# Altium schematic sheet Power.SchDoc
size C
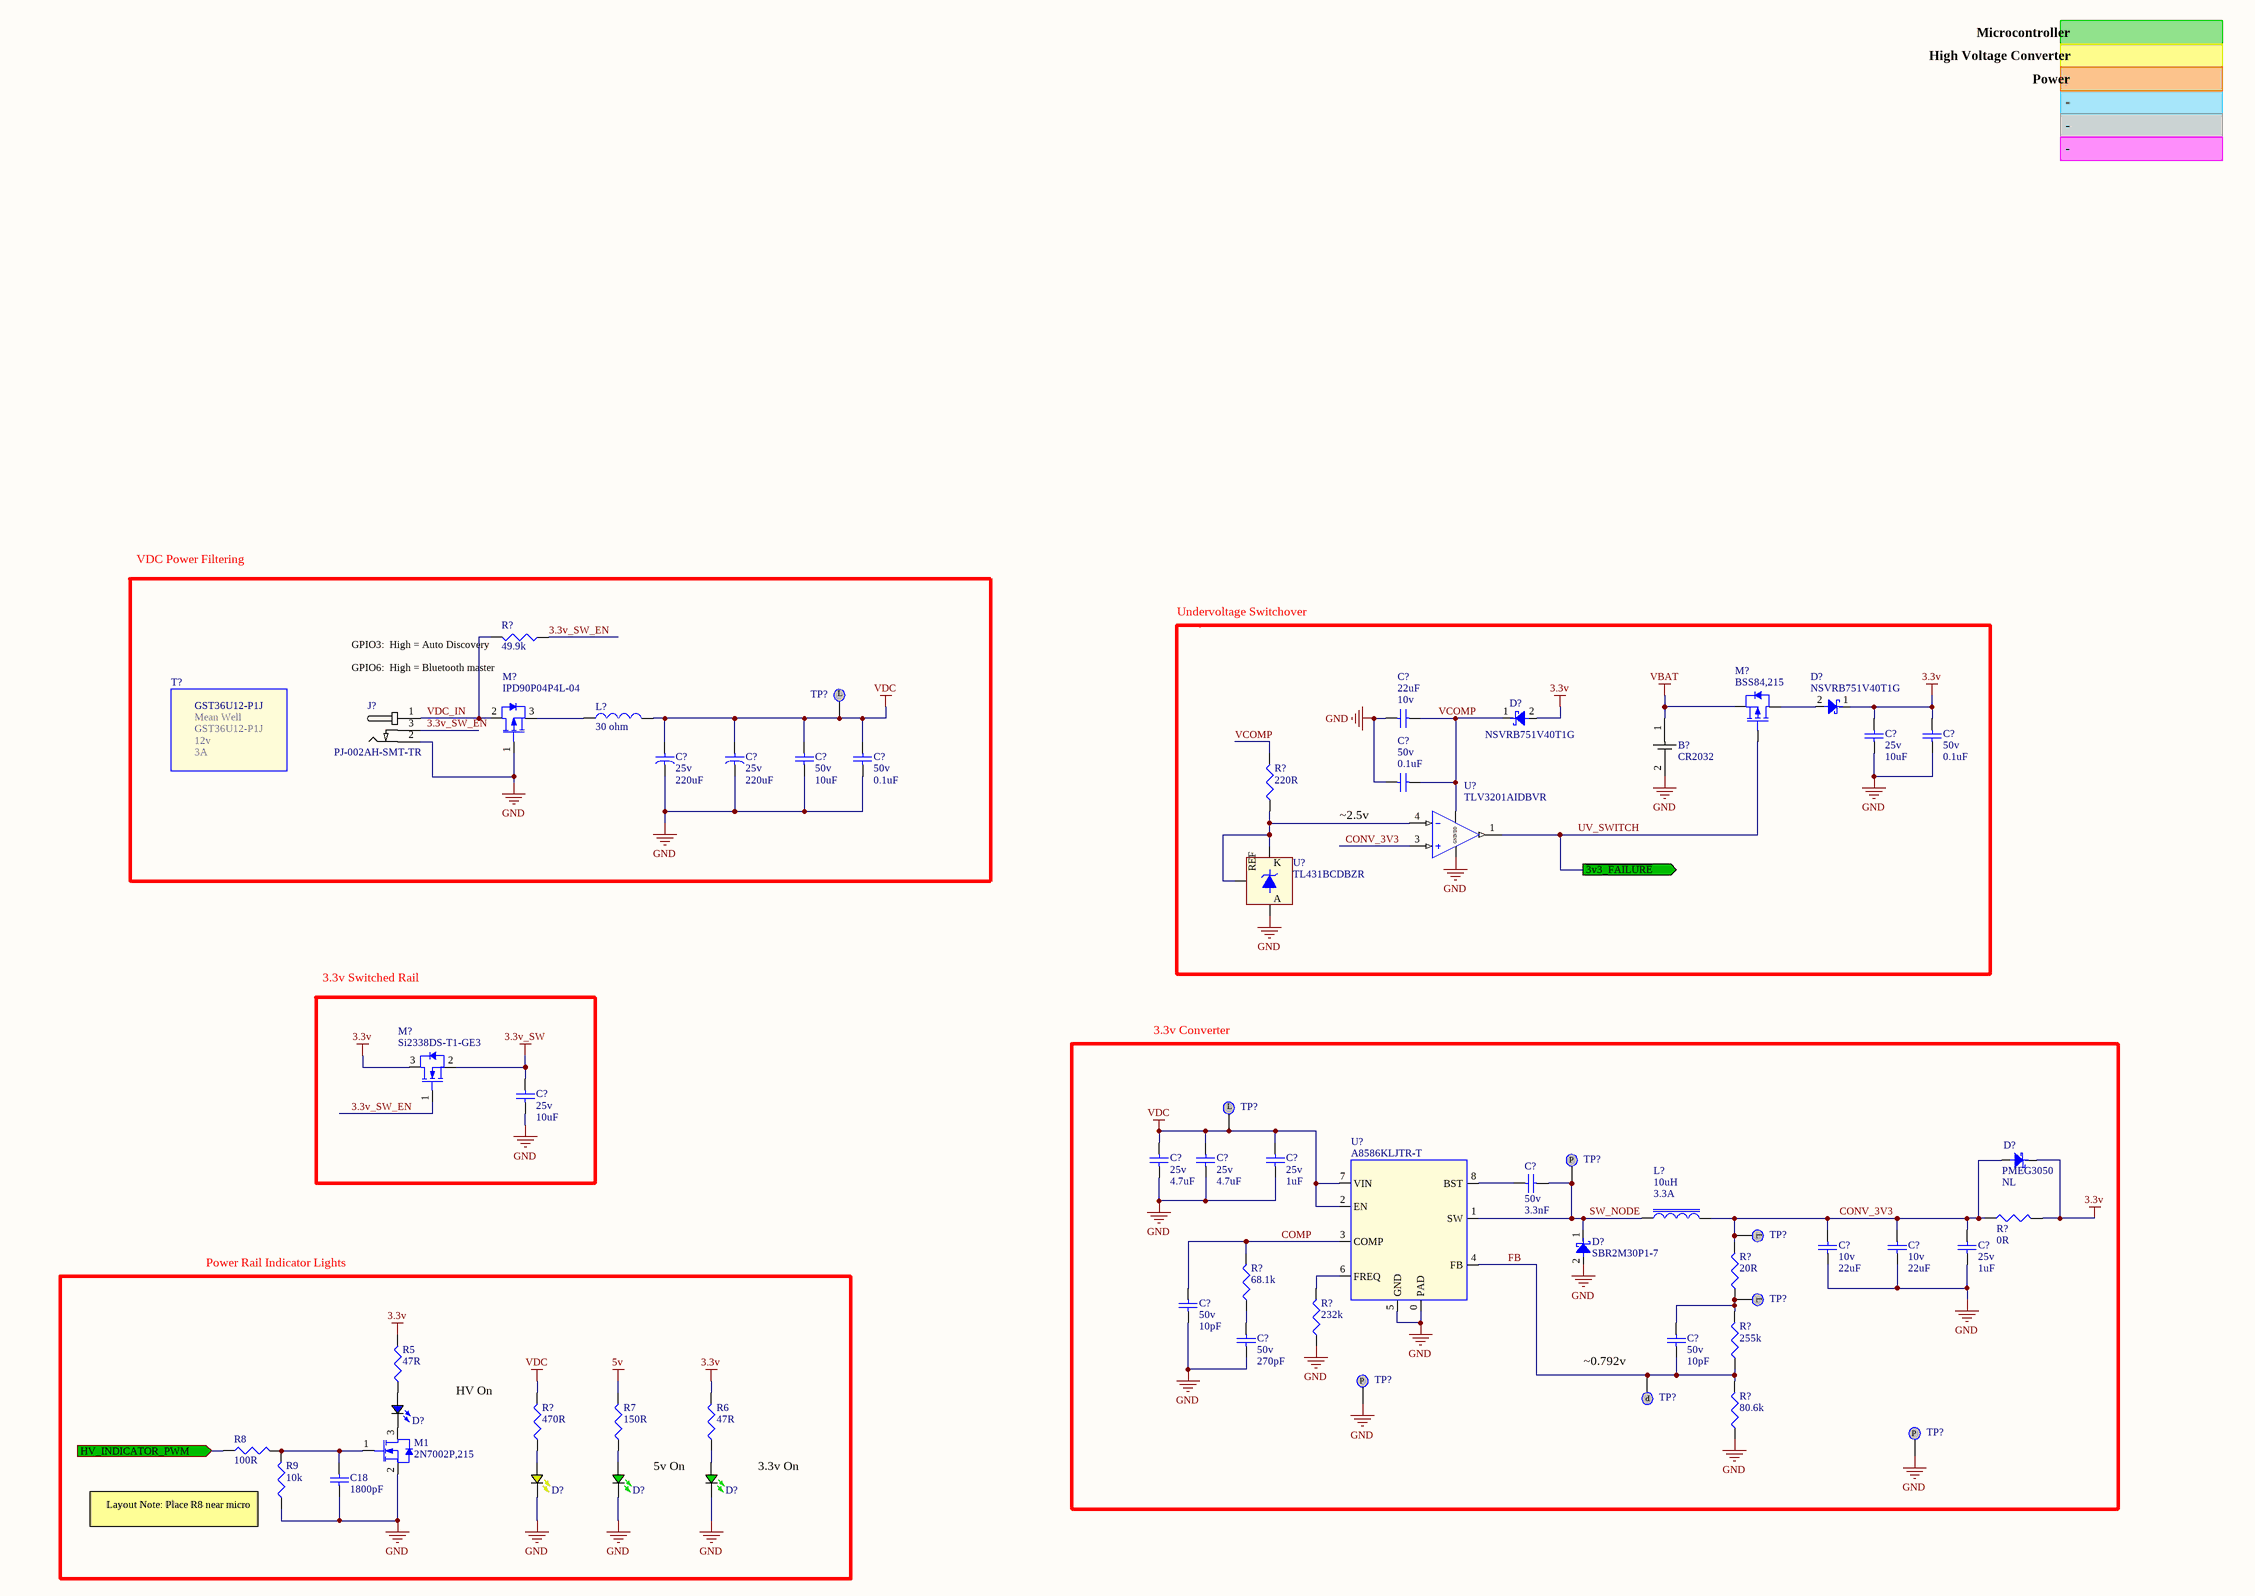
[diagram p0: Power.SchDoc]

## Parts
(Parts that share a designator on the sheet are numbered #1, #2 ... from top to bottom, then left to right.)
B?  CR2032  [2032 Holder]
C18  1800pF  [CAP0603R]
C?#1  Voltage: 10v  [CAP1210R]  (hidden comment: 22uF)
C?#2  Voltage: 25v  [CAP1206R]  (hidden comment: 10uF)
C?#3  Voltage: 50v  [CAP0603R]  (hidden comment: 0.1uF)
C?#4  Voltage: 25v  [SMD ELEC CAP (D=6.3, L=7.7, H=8)]  (hidden comment: 220uF)
C?#5  Voltage: 25v  [SMD ELEC CAP (D=6.3, L=7.7, H=8)]  (hidden comment: 220uF)
C?#6  Voltage: 50v  [CAP1206R]  (hidden comment: 10uF)
C?#7  Voltage: 50v  [CAP0603R]  (hidden comment: 0.1uF)
C?#8  Voltage: 50v  [CAP0603R]  (hidden comment: 0.1uF)
C?#9  Voltage: 25v  [CAP1206R]  (hidden comment: 10uF)
C?#10  Voltage: 25v  [CAP1206R]  (hidden comment: 4.7uF)
C?#11  Voltage: 25v  [CAP1206R]  (hidden comment: 4.7uF)
C?#12  Voltage: 25v  [CAP0603R]  (hidden comment: 1uF)
C?#13  Voltage: 50v  [CAP0603R]  (hidden comment: 3.3nF)
C?#14  Voltage: 10v  [CAP1210R]  (hidden comment: 22uF)
C?#15  Voltage: 10v  [CAP1210R]  (hidden comment: 22uF)
C?#16  Voltage: 25v  [CAP0603R]  (hidden comment: 1uF)
C?#17  Voltage: 50v  [CAP0402R]  (hidden comment: 10pF)
C?#18  Voltage: 50v  [CAP0603R]  (hidden comment: 270pF)
C?#19  Voltage: 50v  [CAP0402R]  (hidden comment: 10pF)
D?#1  NSVRB751V40T1G  [SOD-323 (SC-90)]
D?#2  NSVRB751V40T1G  [SOD-323 (SC-90)]
D?#3  PMEG3050  LOAD: NL  [SOD128]
D?#4  SBR2M30P1-7  [PowerDI123]
D?#5  LTST-C193TBKT-5A  (value not drawn)
D?#6  LTST-C190AKT  [LED Amber 0603]  (value not drawn)
D?#7  LTST-S270KGKT  [LED Green 0603]  (value not drawn)
D?#8  LTST-S270KGKT  [LED Green 0603]  (value not drawn)
J?  PJ-002AH-SMT-TR  [PJ-002AH-SMT-TR]
L?#1  30 ohm  [RES0805R]
L?#2  10uH  CURRENT: 3.3A
M1  2N7002P,215  [SOT23-3M]
M?#1  BSS84,215  [SOT23-3M]
M?#2  IPD90P04P4L-04  [DPAK2]
M?#3  Si2338DS-T1-GE3  [SOT23-3M]
R5  47R  [RES0603R]
R6  47R  [RES0603R]
R7  150R  [RES0603R]
R8  100R  [RES0603R]
R9  10k  [RES0603R]
R?#1  49.9k  [RES0402R]
R?#2  220R  [RES0402R]
R?#3  0R  [RES1206R]
R?#4  20R  [RES0402R]
R?#5  68.1k  [RES0402R]
R?#6  232k  [RES0402R]
R?#7  255k  [RES0402R]
R?#8  80.6k  [RES0402R]
R?#9  470R  [RES0603R]
T?  GST36U12-P1J  MFG: Mean Well  VOUT: 12v  CURRENT: 3A
TP?#1  5001  [5001 Testpoint]  (value not drawn)
TP?#2  5001  [5001 Testpoint]  (value not drawn)
TP?#3  NONE  [TESTPOINT - 1.5mm Round Pad]  (value not drawn)
TP?#4  5001  [5001 Testpoint]  (value not drawn)
TP?#5  5001  [5001 Testpoint]  (value not drawn)
TP?#6  NONE  [TESTPOINT - 1.5mm Round Pad]  (value not drawn)
TP?#7  NONE  [TESTPOINT - 1.5mm Round Pad]  (value not drawn)
TP?#8  NONE  [TESTPOINT - 1.5mm Round Pad]  (value not drawn)
U?#1  TLV3201AIDBVR  [SOT23-5]
U?#2  TL431BCDBZR  [SOT23-3M]
U?#3  A8586KLJTR-T  [HSOIC-8]

## Blocks framed on the sheet
VDC Power Filtering: C?#4-C?#7 J? L?#1 M?#2 R?#1 T? TP?#1
3.3v Switched Rail: C?#9 M?#3

## Ports
HV_INDICATOR_PWM (in), ~{3v3_FAILURE} (out)

## Nets
3.3v: C?#2.1 C?#3.1 D?#1.1(K) D?#2.2(A) D?#3.1(K) M?#3.3(DRAIN) R5.2 R6.2 R?#3.2
3.3v_SW: C?#9.1 M?#3.2(SOURCE)
5v: R7.2
GND: B?.2 C18.2 C?#1.2 C?#2.2 C?#3.2 C?#4.1 C?#5.1 C?#6.2 C?#7.2 C?#8.2 C?#9.2 C?#10.2 C?#11.2 C?#12.2 C?#14.2 C?#15.2 C?#16.2 C?#17.2 C?#18.2 D?#4.2(A) D?#6.1(K) D?#7.1(K) D?#8.1(K) J?.2(RING) M1.2(SOURCE) M?#2.1(GATE) R9.1 R?#6.1 R?#8.1 TP?#7.1 TP?#8.1 U?#1.2(GND) U?#2.3(A) U?#3.0(PAD) U?#3.5(GND)
VBAT: B?.1 M?#1.2(DRAIN)
VDC: C?#4.2 C?#5.2 C?#6.1 C?#7.1 C?#10.1 C?#11.1 C?#12.1 L?#1.2 R?#9.2 TP?#1.1 TP?#2.1 U?#3.2(EN) U?#3.7(VIN)
3.3v_SW_EN: J?.3(SWITCH) M?#3.1(GATE) R?#1.1
COMP: C?#17.1 R?#5.2 U?#3.3(COMP)
CONV_3V3: C?#14.1 C?#15.1 C?#16.1 D?#3.2(A) L?#2.2 R?#3.1 R?#4.2 TP?#4.1 U?#1.3(+)
FB: C?#19.2 R?#7.1 R?#8.2 TP?#6.1 U?#3.4(FB)
HV_INDICATOR_PWM: R8.1 ; port HV_INDICATOR_PWM
SW_NODE: C?#13.2 D?#4.1(K) L?#2.1 TP?#3.1 U?#3.1(SW)
UV_SWITCH: M?#1.1(GATE) U?#1.1(OUT) ; port ~{3v3_FAILURE}
VCOMP: C?#1.1 C?#8.1 D?#2.1(K) R?#2.2 U?#1.5(VDD)
VDC_IN: J?.1(PIN) M?#2.2(DRAIN) R?#1.2
NetC18_1: C18.1 M1.1(GATE) R8.2 R9.2
NetC?#13_1: C?#13.1 U?#3.8(BST)
NetC?#18_1: C?#18.1 R?#5.1
NetC?#19_1: C?#19.1 R?#4.1 R?#7.2 TP?#5.1
NetD?#1_2: D?#1.2(A) M?#1.3(SOURCE)
NetD?#5_1: D?#5.1(K) M1.3(DRAIN)
NetD?#5_2: D?#5.2(A) R5.1
NetD?#6_2: D?#6.2(A) R?#9.1
NetD?#7_2: D?#7.2(A) R7.1
NetD?#8_2: D?#8.2(A) R6.1
NetL?#1_1: L?#1.1 M?#2.3(SOURCE)
NetR?#2_1: R?#2.1 U?#1.4(-) U?#2.1(K) U?#2.2(REF)
NetR?#6_2: R?#6.2 U?#3.6(FREQ)

## Notes on the sheet
- Microcontroller
- High Voltage Converter
- -
- Power
- Undervoltage Switchover
- (near C?#8) ~2.5v
- 3.3v Converter
- Power Rail Indicator Lights
- HV On
- (near TP?#6) ~0.792v
- (near D?#7) 5v On
- (near D?#8) 3.3v On
- (near R9) Layout Note: Place R8 near micro
- (in symbol GST36U12-P1J) GPIO3:  High = Auto Discovery / GPIO6:  High = Bluetooth master / GPIO7:  Low = 115200bps, High = 9600bps /
- (in symbol Testpoint 1.5mm Pad) P
- (in symbol Testpoint Loop) L

## Library data of the parts
B? = 2032 Coin Cell Holder: SMD Coin Cell Holder for CR2032; MFG_PN: SMTU2032-LF.TR; MFG: RENATA; CELL_TYPE: CR2032
C18 = 1800pF: Tolerance: 5%; MFG1_PN: VJ0603Y182JXAAC; MFG1: Vishay; Voltage: 50v; Value: 1800pF
C?#1 C?#14 C?#15 = 22uF 10v (1210): Tolerance: 10%; MFG_PN: GCM32ER71A226ME12L; MFG: MURATA; LOAD: NL; Value: 22uF
C?#2 C?#9 = 10uF 25v (1206): Tolerance: 10%; MFG_PN: GRJ31CR71E106KE11L; MFG: MURATA; LOAD: NL; Value: 10uF
C?#3 C?#7 C?#8 = 0.1uF 50v (0603): MFG_PN: VJ0603V104ZXAPW1BC; MFG: Vishay; LOAD: NL; Value: 0.1uF
C?#4 C?#5 = 220uF / 25v: Tolerance: 20%; MFG_PN: EEE-FTE221XAP; MFG: PANASONIC; ESR: 160mohm; LOAD: NL; Value: 220uF
C?#6 = 10uF 50v (1206): Tolerance: 10%; MFG_PN: C3216X5R1H106K160AB; MFG: TDK; LOAD: NL; Value: 10uF
C?#10 C?#11 = 4.7uF 25v (1206): Tolerance: 10%; MFG_PN: GCM31CR71E475KA55L; MFG: Murata; LOAD: NL; Value: 4.7uF
C?#12 C?#16 = 1uF 25v (0603): MFG_PN: VJ0805V105ZXXTW1BC; MFG: Vishay; LOAD: NL; Value: 1uF
C?#13 = 47nF 50v (0603): Tolerance: 10%; MFG_PN: VJ0603Y473KXACW1BC; MFG: VISHAY; Value: 3.3nF
C?#17 C?#19 = 10pF 50v (0402): Tolerance: 10%; MFG_PN: VJ0402Y100KXACW1BC; MFG: Vishay; LOAD: NL; Value: 10pF
C?#18 = 270pF 50v (0603): Tolerance: 5%; MFG_PN: VJ0603A271JXACW1BC; MFG: Vishay; LOAD: NL; Value: 270pF
D?#1 D?#2 = NSVRB751V40T1G: Schottky, 30mA, 0.28v; MFG: ON Semiconductor; Vf: 0.28v; CURRENT: 30mA; MFG_PN: NSVRB751V40T1G
D?#3 = PMEG3050EP: MFG: NXP; CURRENT: 5A; VF: 0.35v; MFG_PN: PMEG3050EP,115
D?#4 = SBR2M30P1-7: Schottky Diode - 2A; MFG: DIODES INC; VF: 390mV; LOAD: NL; Value: *; CURRENT: 2A; MFG_PN: SBR2M30P1-7
D?#5 = LED Blue 0603: MFG: Lite On; VFORWARD: 2.8v; CURRENT: 20mA; COLOR: Blue; MFG_PN: LTST-C193TBKT-5A
D?#6 = LED Amber 0603: MFG: Lite On; VFORWARD: 2.1v; CURRENT: 20mA; COLOR: Amber; MFG_PN: LTST-C190AKT
D?#7 D?#8 = LED Green 0603: MFG: Lite On; VFORWARD: 2v; CURRENT: 20mA; COLOR: Green; MFG_PN: LTST-S270KGKT
J? = PJ-002AH-SMT-TR: 2.0mm ID/6.5mm OD Barrel Plug; MFG: CUI; VOLTAGE: 16v; CURRENT: 5A; MFG_PN: PJ-002AH-SMT-TR
L?#1 = EMI Ferrite (0805): MFG: MURATA; MFG_PN: BLM21PG300SN1D; CURRENT: 3A; LOAD: NL; TOLERANCE: 20%; IMPEDANCE: 30 ohm
L?#2 = 10uH 3.3A: Inductor, 10uH, 3.3A; MFG: LAIRD; MFG_PN: TYS8040100M-10; RES: 29mOhm; ISAT: 3.6A; VALUE: 10uH
M1 = 2N7002: NFET_SINGLE_360mA_60V; LOAD: NL; MFG: NXP; VDS_MAX: 60v; I_MAX: 360mA; VGS_MAX: 20v; P_MAX: *; RDS_ON: *; MFG_PN: 2N7002P,215
M?#1 = BSS84: PFET_SINGLE_130mA_50v; LOAD: NL; MFG: NXP; VDS_MAX: 50v; I_MAX: 130mA; VGS_MAX: 20v; P_MAX: 250mW; RDS_ON: 6R; MFG_PN: BSS84,215
M?#2 = IPD90P04P4L-04: PFET_SINGLE_90A_40v; LOAD: NL; MFG: INFINEON; VDS_MAX: -40v; I_MAX: 90A; VGS_MAX: 16v; P_MAX: 125W; RDS_ON: 4.3m; VGS_TH: -2.2v; Q_GATE: 176nC; MFG_PN: IPD90P04P4L-04
M?#3 = Si2338DS: NFET_SINGLE_6A_30V; LOAD: NL; MFG: VISHAY; VDS_MAX: 30v; I_MAX: 6A; VGS_MAX: 20v; RDS_ON: 23m; Q_GATE: 8.2nC; P_MAX: *; MFG_PN: Si2338DS-T1-GE3
R5 R6 = 47R: Tolerance: 1%; POWER: 0.1W; MFG1_PN: CRCW060347R0FKEA; MFG1: Vishay; Load: NL; Value: 47R
R7 = 150R: Tolerance: 1%; POWER: 0.1W; MFG1_PN: CRCW0603150RFKEA; MFG1: Vishay; Load: NL; Value: 150R
R8 = 100R: Tolerance: 1%; POWER: 0.1W; MFG1_PN: CRCW0603100RFKEA; MFG1: Vishay; Load: NL; Value: 100R
R9 = 10K: Tolerance: 1%; POWER: 0.1W; MFG1_PN: CRCW060310K0FKEA; MFG1: Vishay; Load: NL; Value: 10k
R?#1 = 49.9k (0402): Tolerance: 1%; POWER: 63mW; MFG_PN: CRCW040249K9FKED; MFG: Vishay; Load: NL; Value: 49.9k
R?#2 = 220R (0402): Tolerance: 1%; POWER: 63mW; MFG_PN: CRCW0402220RFKED; MFG: Vishay; Load: NL; Value: 220R
R?#3 = 0R (1206): 0R, 1206; MFG_PN: CRCW12060000Z0EA; MFG: Vishay; Load: NL; Value: 0R
R?#4 = 20R (0402): Tolerance: 1%; POWER: 63mW; MFG_PN: CRCW040220R0FKED; MFG: Vishay; Load: NL; Value: 20R
R?#5 = 68.1k (0402): Tolerance: 1%; POWER: 63mW; MFG_PN: CRCW0402232KFKED; MFG: Vishay; Load: NL; Value: 68.1k
R?#6 = 232k (0402): Tolerance: 1%; POWER: 63mW; MFG_PN: CRCW0402232KFKED; MFG: Vishay; Load: NL; Value: 232k
R?#7 = 255k (0402): Tolerance: 1%; POWER: 63mW; MFG_PN: CRCW0402255KFKED; MFG: Vishay; Load: NL; Value: 255k
R?#8 = 80.6k (0402): Tolerance: 1%; POWER: 63mW; MFG_PN: CRCW040280K6FKED; MFG: Vishay; Load: NL; Value: 80.6k
R?#9 = 470R (0603): Tolerance: 1%; POWER: 0.1W; MFG_PN: CRCW0603470RFKEA; MFG: Vishay; Load: NL; Value: 470R
T? = GST36U12-P1J: 12v/3A Wall Mount AC Adapter; PLUG_TYPE: 2.1mm Barrel Plug; MFG_PN: GST36U12-P1J
TP?#1 TP?#2 TP?#4 TP?#5 = Testpoint Loop: MFG: KEYSTONE; MFG_PN: 5001
TP?#3 TP?#6-TP?#8 = Testpoint 1.5mm Pad: 1.5mm Testpoint
U?#1 = TLV3201AIDBVR: High Speed Analog Comparator; LOAD: NL; MFG: TI; OUTPUT_TYPE: PUSH-PULL; RESPONSE_TIME: 47ns; MFG_PN: TLV3201AIDBVR
U?#2 = TL431: Voltage Reference; MFG: TI; MFG_PN: TL431BCDBZR
U?#3 = A8586: Buck Converter, 3.5A, Adj; MFG: ALLEGRO; MFG_PN: A8586KLJTR-T; CURRENT: 3.5A; VOUT: ADJ